# EAGLE schematic EagleSample (EAGLE 8.0.2)
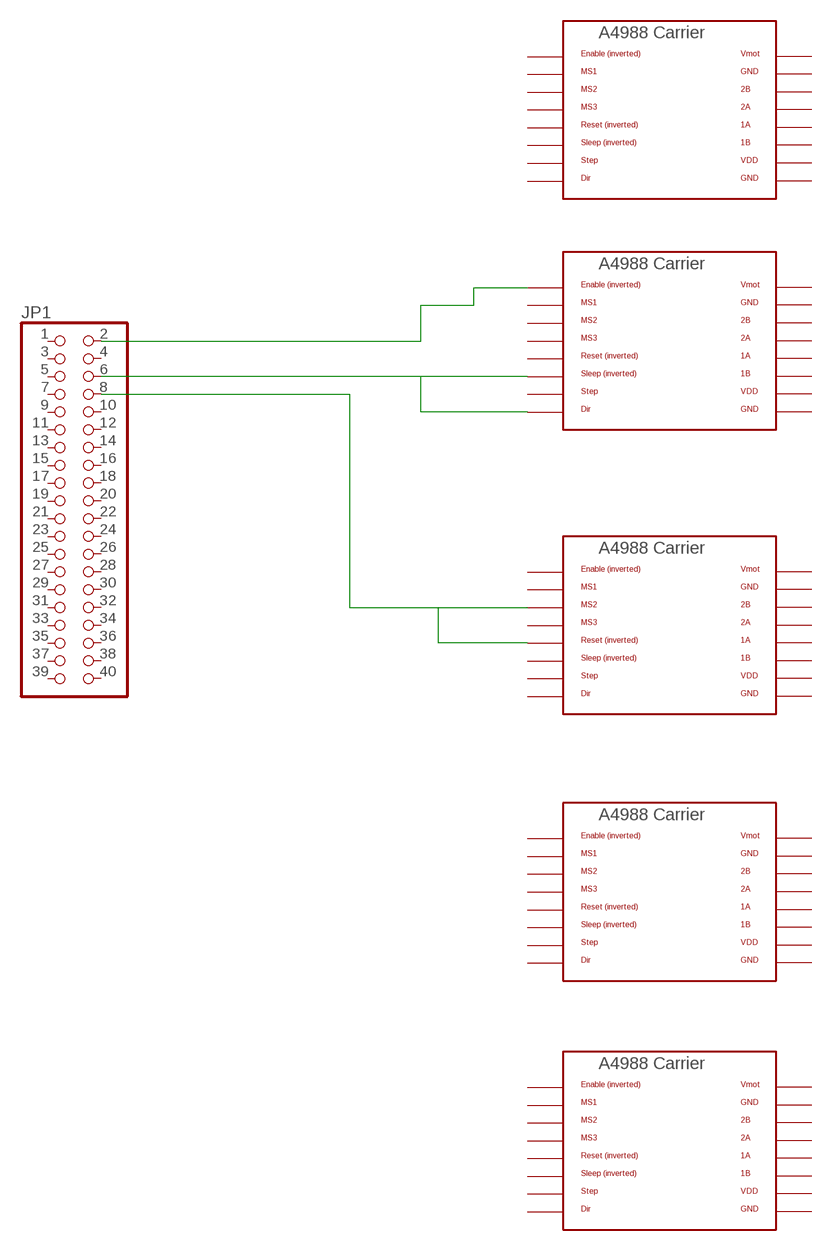
[diagram p0: schematic, sheet 1]

## Parts
JP1  PINHD-2X20  [2X20]
U$5  A4988BREAKOUT  [A4988BREAKOUT]
U$6  A4988BREAKOUT  [A4988BREAKOUT]
U$7  A4988BREAKOUT  [A4988BREAKOUT]
U$8  A4988BREAKOUT  [A4988BREAKOUT]
U$9  A4988BREAKOUT  [A4988BREAKOUT]

## Nets
N$1: JP1.2 U$5.EN
N$2: JP1.6 U$5.DIR U$5.SLP(SLEEP)
N$3: JP1.8 U$8.MS2 U$8.RST
Unconnected: JP1.1 JP1.3 JP1.4 JP1.5 JP1.7 JP1.9 JP1.10 JP1.11 JP1.12 JP1.13 JP1.14 JP1.15 JP1.16 JP1.17 JP1.18 JP1.19 JP1.20 JP1.21 JP1.22 JP1.23 JP1.24 JP1.25 JP1.26 JP1.27 JP1.28 JP1.29 JP1.30 JP1.31 JP1.32 JP1.33 JP1.34 JP1.35 JP1.36 JP1.37 JP1.38 JP1.39 JP1.40 U$5.1A U$5.1B U$5.2A U$5.2B U$5.MS1 U$5.MS2 U$5.MS3 U$5.RST U$5.STEP U$6.1A U$6.1B U$6.2A U$6.2B U$6.DIR U$6.EN U$6.MS1 U$6.MS2 U$6.MS3 U$6.RST U$6.SLP(SLEEP) U$6.STEP U$7.1A U$7.1B U$7.2A U$7.2B U$7.DIR U$7.EN U$7.MS1 U$7.MS2 U$7.MS3 U$7.RST U$7.SLP(SLEEP) U$7.STEP U$8.1A U$8.1B U$8.2A U$8.2B U$8.DIR U$8.EN U$8.MS1 U$8.MS3 U$8.SLP(SLEEP) U$8.STEP U$9.1A U$9.1B U$9.2A U$9.2B U$9.DIR U$9.EN U$9.MS1 U$9.MS2 U$9.MS3 U$9.RST U$9.SLP(SLEEP) U$9.STEP

## Power pins joined to a net without a drawn wire
GND: U$5.GND U$5.GND@0(GND) U$6.GND U$6.GND@0(GND) U$7.GND U$7.GND@0(GND) U$8.GND U$8.GND@0(GND) U$9.GND U$9.GND@0(GND)
VDD: U$5.VDD U$6.VDD U$7.VDD U$8.VDD U$9.VDD
VMOT: U$5.VMOT U$6.VMOT U$7.VMOT U$8.VMOT U$9.VMOT

## Library data of the parts
JP1 = pinhead:PINHD-2X20: PIN HEADER
U$5-U$9 = RepRapjr:A4988BREAKOUT